# Altium schematic sheet 04-OUTPUT.SchDoc: *OUTPUT
size A; SheetNumber: 5; SheetTotal: 7
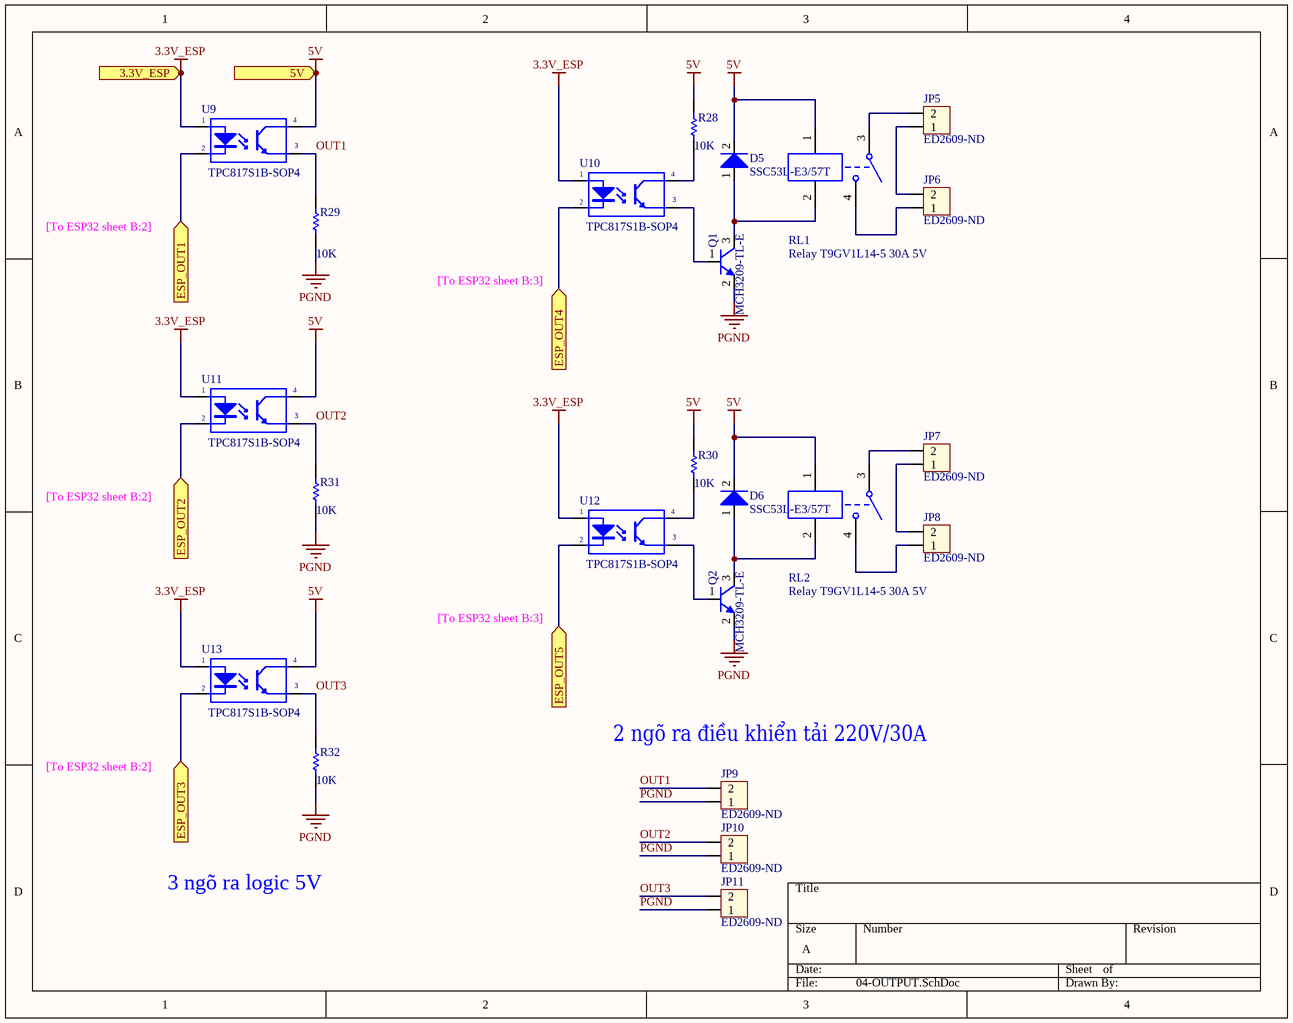
[diagram p0: 04-OUTPUT.SchDoc]

## Parts
D5  SSC53L-E3/57T  [SSC53L-E3/57T]
D6  SSC53L-E3/57T  [SSC53L-E3/57T]
JP5  ED2609-ND  [DOMINO_OSTTC_2P]
JP6  ED2609-ND  [DOMINO_OSTTC_2P]
JP7  ED2609-ND  [DOMINO_OSTTC_2P]
JP8  ED2609-ND  [DOMINO_OSTTC_2P]
JP9  ED2609-ND  [DOMINO_OSTTC_2P]
JP10  ED2609-ND  [DOMINO_OSTTC_2P]
JP11  ED2609-ND  [DOMINO_OSTTC_2P]
Q1  MCH3209-TL-E  [MCH3209-TL-E  SOT-323]
Q2  MCH3209-TL-E  [MCH3209-TL-E  SOT-323]
R28  10K  [Res 0805 SMD]
R29  10K  [Res 0805 SMD]
R30  10K  [Res 0805 SMD]
R31  10K  [Res 0805 SMD]
R32  10K  [Res 0805 SMD]
RL1  Relay T9GV1L14-5 30A 5V  [Relay T9GV1L14-5 30A 5V]
RL2  Relay T9GV1L14-5 30A 5V  [Relay T9GV1L14-5 30A 5V]
U9  TPC817S1B-SOP4  [TPC817-4SOP]
U10  TPC817S1B-SOP4  [TPC817-4SOP]
U11  TPC817S1B-SOP4  [TPC817-4SOP]
U12  TPC817S1B-SOP4  [TPC817-4SOP]
U13  TPC817S1B-SOP4  [TPC817-4SOP]

## Ports
3.3V_ESP (in), 5V (in), ESP_OUT1 (in), ESP_OUT2 (in), ESP_OUT3 (in), ESP_OUT4 (in), ESP_OUT5 (in)

## Nets
3.3V_ESP: U9.1(A) U10.1(A) U11.1(A) U12.1(A) U13.1(A) ; port 3.3V_ESP
5V: D5.2(K) D6.2(K) R28.2 R30.2 RL1.1 RL2.1 U9.4(C) U11.4(C) U13.4(C) ; port 5V
PGND: JP9.1 JP10.1 JP11.1 Q1.2(E) Q2.2(E) R29.1 R31.1 R32.1
ESP_OUT1: U9.2(K) ; port ESP_OUT1
ESP_OUT2: U11.2(K) ; port ESP_OUT2
ESP_OUT3: U13.2(K) ; port ESP_OUT3
ESP_OUT4: U10.2(K) ; port ESP_OUT4
ESP_OUT5: U12.2(K) ; port ESP_OUT5
OUT1: JP9.2 R29.2 U9.3(E)
OUT2: JP10.2 R31.2 U11.3(E)
OUT3: JP11.2 R32.2 U13.3(E)
NetD5_1: D5.1(A) Q1.3(C) RL1.2
NetD6_1: D6.1(A) Q2.3(C) RL2.2
NetJP5_1: JP5.1 JP6.2
NetJP5_2: JP5.2 RL1.3
NetJP6_1: JP6.1 RL1.4
NetJP7_1: JP7.1 JP8.2
NetJP7_2: JP7.2 RL2.3
NetJP8_1: JP8.1 RL2.4
NetQ1_1: Q1.1(B) U10.3(E)
NetQ2_1: Q2.1(B) U12.3(E)
NetR28_1: R28.1 U10.4(C)
NetR30_1: R30.1 U12.4(C)

## Notes on the sheet
- [To ESP32 sheet B:2]
- [To ESP32 sheet B:3]
- (near JP9) 2 ngõ ra điều khiển tải 220V/30A
- 3 ngõ ra logic 5V

## Library data of the parts
D5 D6 = 10A10: DIODE SCHOTTKY 30V 5A DO214AB; ComponentLink1Description: Datasheet; ComponentLink1URL: D:\Dropbox\Datasheets\Diodes and Rectifiers\Diodes\10AXX.pdf; Digikey: SSC53L-E3/57TGICT-ND
JP5-JP11 = Con2: 2 Position Wire to Board Terminal Block Horizontal with Board 0.200" (5.08mm) Through Hole; Value: Connector 2; Digikey: ED2609-ND
Q1 Q2 = 2SC1815: Bipolar (BJT) Transistor NPN 30V 3A 450MHz 800mW Surface Mount 3-MCPH; ComponentLink1Description: Datasheet; ComponentLink1URL: D:\Dropbox\Datasheets\Transistors\P Channel Bipolar\2SC1815.pdf; Digikey: MCH3209-TL-EOSCT-ND
R28-R32 = 249K/R0805/1%: RES SMD 249K OHM 1% 1/10W 0805; Manufacturer: Yageo; Manufacturer Part Number: RC0603FR-07249KL; Power (Watts): 0.1W, 1/10W; Temperature Coefficient: ±100ppm/°C; Supplier 1: Digi-Key; RoHS: RoHS Compliant; Category: Resistors; Stock 1: 370515; Pricing 1: 1=0.1, 10=0.015, 100=0.006, 1000=0.00268, 2500=0.00233 (USD); Packaging: Cut Tape (CT); Part Status: Active; Tolerance: ±1%; Composition: Thick Film; Features: Moisture Resistant; Operating Temperature: -55°C ~ 155°C; Package / Case: 0603 (1608 Metric); Supplier Device Package: 0603; Size / Dimension: 0.063" L x 0.032" W (1.60mm x 0.80mm); Height - Seated (Max): 0.022" (0.55mm); Failure Rate: -; ComponentLink1URL: http://www.yageo.com/documents/recent/PYu-RC_Group_51_RoHS_L_8.pdf; ComponentLink1Description: http://www.yageo.com/documents/recent/PYu-RC_Group_51_RoHS_L_8.pdf
RL1 RL2 = Relay T9GV1L14-5 30A 5V: General Purpose Relay SPST-NO (1 Form A) 5VDC Coil Through Hole; Digikey: T9GV1L14-5
U9-U13 = PC817: Optoisolator Transistor Output 5000Vrms 1 Channel 4-SOP; Digikey: TPC817S1BRAGCT-ND